# EAGLE design EEG (EAGLE 6.3)
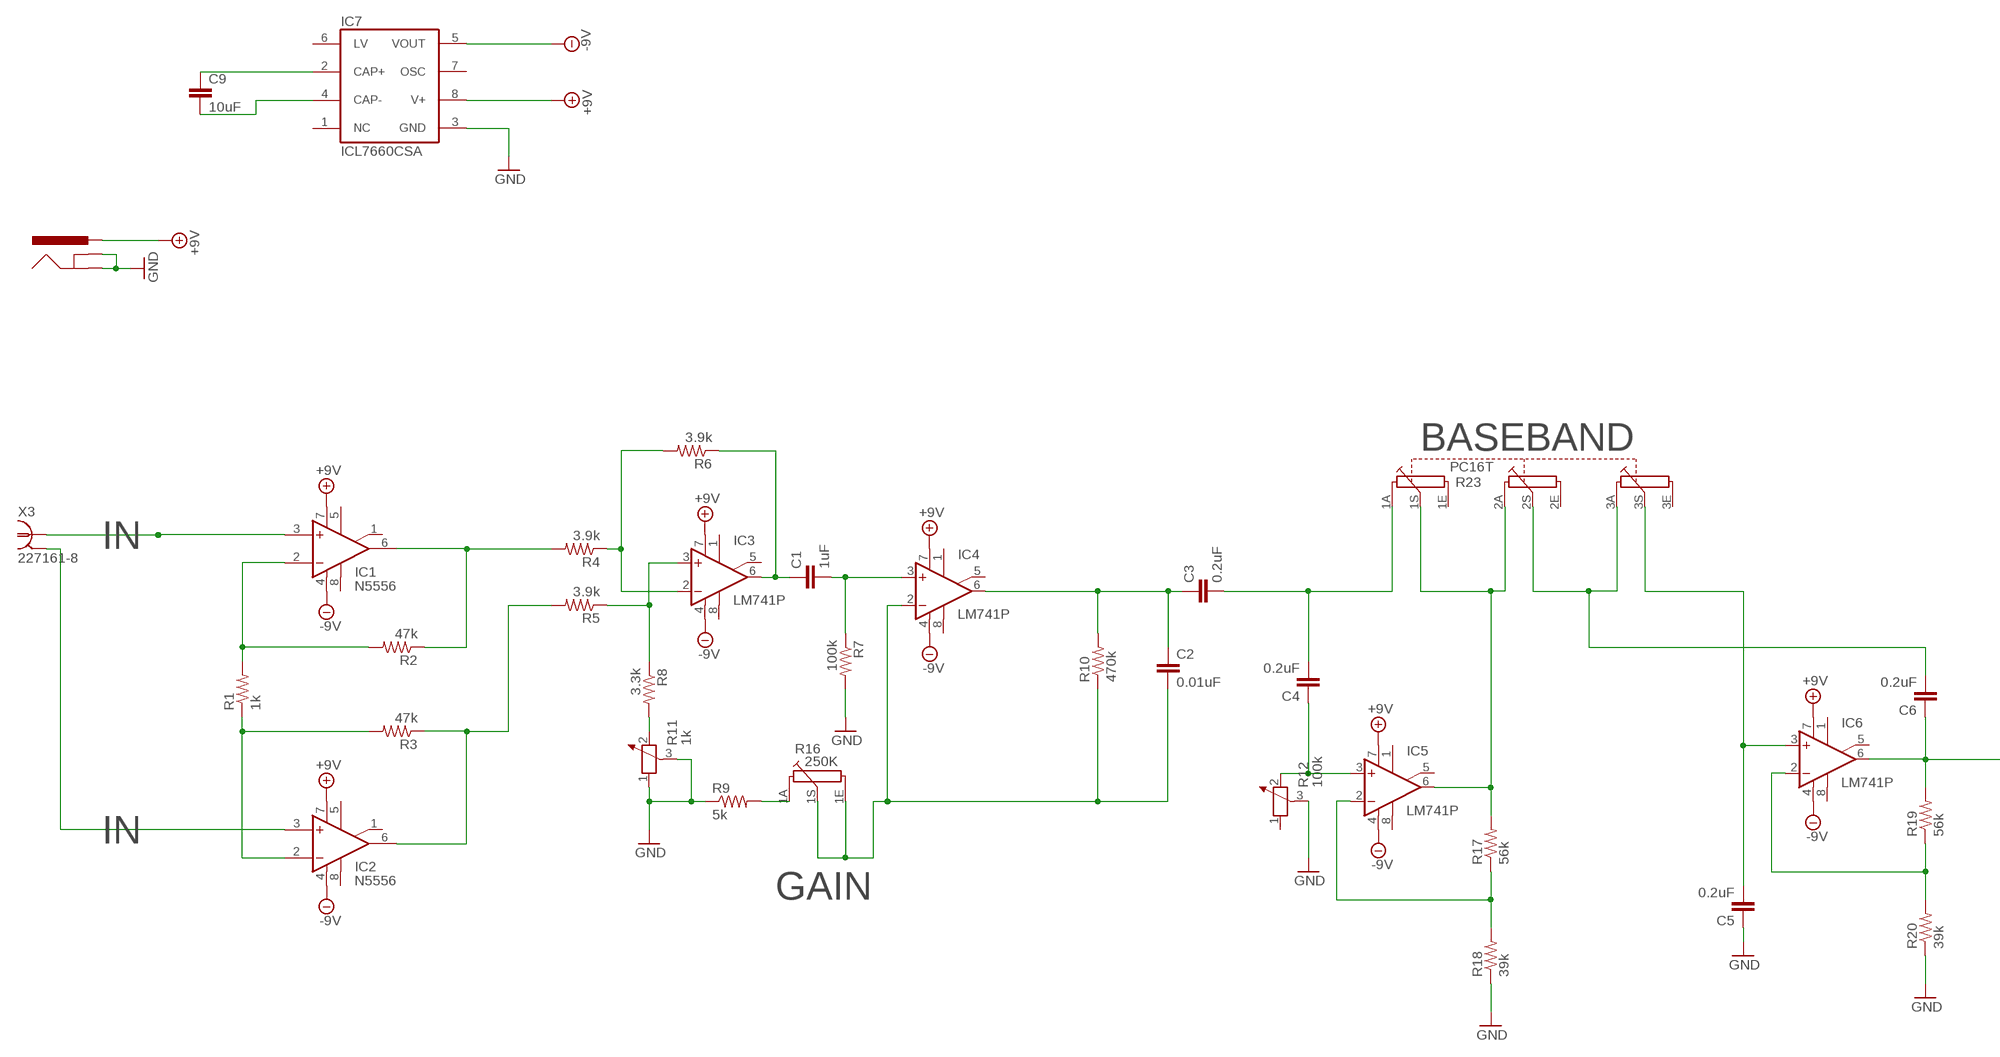
[diagram p0: schematic, sheet 1, part 1 of 2]
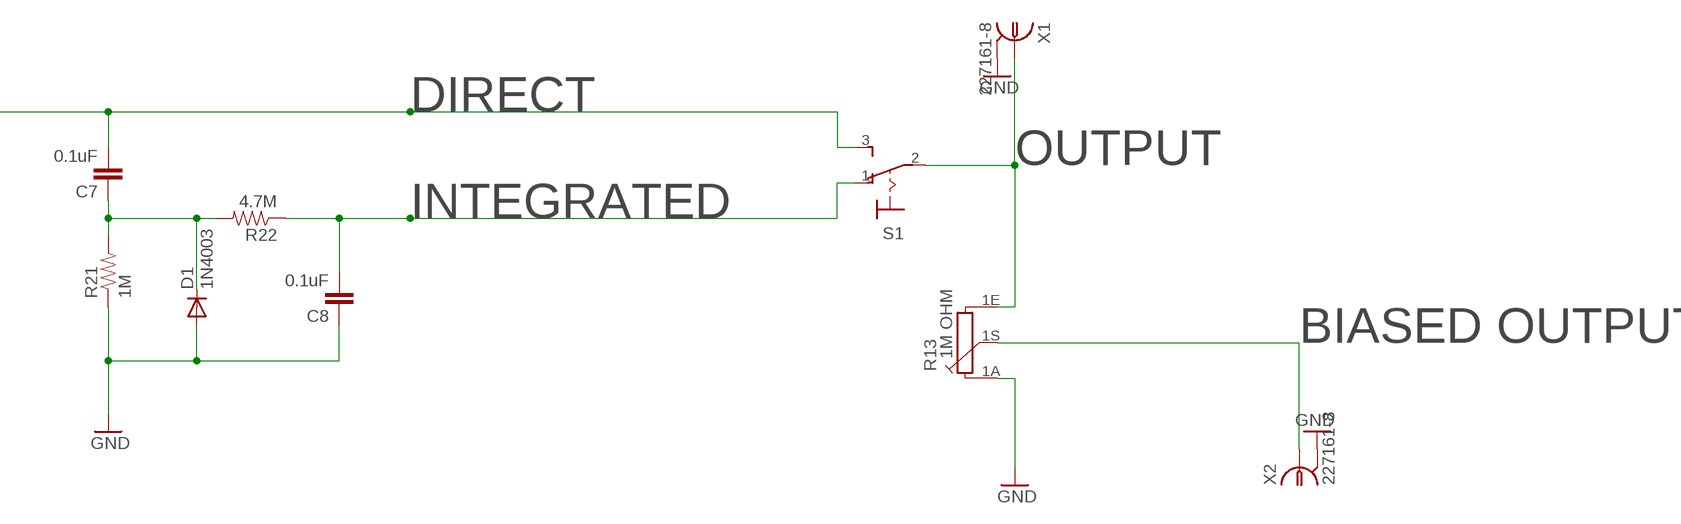
[diagram p1: schematic, sheet 1, part 2 of 2]

## Parts
C1  1uF  C-EUC1206  [C1206]
C2  0.01uF  C-EUC1206  [C1206]
C3  0.2uF  C-EUC1206  [C1206]
C4  0.2uF  C-EUC1206  [C1206]
C5  0.2uF  C-EUC1206  [C1206]
C6  0.2uF  C-EUC1206  [C1206]
C7  0.1uF  C-EUC1206  [C1206]
C8  0.1uF  C-EUC1206  [C1206]
C9  10uF  C-EUC1206  [C1206]
D1  1N4003  1N4004  [DO41-10]
IC1  N5556  MAX430CPA  [DIL08]
IC2  N5556  MAX430CPA  [DIL08]
IC3  LM741P  [DIL08]
IC4  LM741P  [DIL08]
IC5  LM741P  [DIL08]
IC6  LM741P  [DIL08]
IC7  ICL7660CSA  [SO08]
J1  SPARKFUN_POWER_JACKPTH  [SPARKFUN_POWER_JACK_PTH]
R1  1k  SPARKFUN_RESISTOR1206  [SPARKFUN_1206]
R2  47k  SPARKFUN_RESISTOR1206  [SPARKFUN_1206]
R3  47k  SPARKFUN_RESISTOR1206  [SPARKFUN_1206]
R4  3.9k  SPARKFUN_RESISTOR1206  [SPARKFUN_1206]
R5  3.9k  SPARKFUN_RESISTOR1206  [SPARKFUN_1206]
R6  3.9k  SPARKFUN_RESISTOR1206  [SPARKFUN_1206]
R7  100k  SPARKFUN_RESISTOR1206  [SPARKFUN_1206]
R8  3.3k  SPARKFUN_RESISTOR1206  [SPARKFUN_1206]
R9  5k  SPARKFUN_RESISTOR1206  [SPARKFUN_1206]
R10  470k  SPARKFUN_RESISTOR1206  [SPARKFUN_1206]
R11  1k  POTENTIOMETER_PT-10  [PT-10]
R12  100k  POTENTIOMETER_PT-10  [PT-10]
R13  1M OHM  PC16S  [PC16S]
R16  250K  PC16S  [PC16S]
R17  56k  SPARKFUN_RESISTOR1206  [SPARKFUN_1206]
R18  39k  SPARKFUN_RESISTOR1206  [SPARKFUN_1206]
R19  56k  SPARKFUN_RESISTOR1206  [SPARKFUN_1206]
R20  39k  SPARKFUN_RESISTOR1206  [SPARKFUN_1206]
R21  1M  SPARKFUN_RESISTOR1206  [SPARKFUN_1206]
R22  4.7M  SPARKFUN_RESISTOR1206  [SPARKFUN_1206]
R23  PC16T  [PC16T]
S1  M9040P  [M9040P]
X1  227161-8  [AMP_227161]
X2  227161-8  [AMP_227161]
X3  227161-8  [AMP_227161]

## Nets
+9V: IC1.7(V+) IC2.7(V+) IC3.7(V+) IC4.7(V+) IC5.7(V+) IC6.7(V+) IC7.8(V+) J1.PWR
-9V: IC1.4(V-) IC2.4(V-) IC3.4(V-) IC4.4(V-) IC5.4(V-) IC6.4(V-) IC7.5(VOUT)
BIASOUT: R13.1S X2.1
DIRECT: C6.1 C7.2 IC6.6(OUT) R19.2 S1.3(S)
GND: C5.1 C8.1 D1.A IC7.3(GND) J1.GND J1.GNDBREAK R7.2 R9.1 R11.1 R11.3 R12.3 R13.1A R18.1 R20.1 R21.1 X1.2(GND) X2.2(GND)
IN0: IC1.3(+IN) X3.1
IN1: IC2.3(+IN) X3.2(GND)
INT: C8.2 R22.1 S1.1(O)
N$1: IC1.2(-IN) R1.2 R2.2
N$2: IC2.2(-IN) R1.1 R3.2
N$3: R9.2 R16.1A
N$5: IC1.6(OUT) R2.1 R4.2
N$6: IC2.6(OUT) R3.1 R5.2
N$7: IC3.2(-IN) R4.1 R6.2
N$8: IC3.3(+IN) R5.1 R8.1
N$9: C1.1 IC3.6(OUT) R6.1
N$10: C1.2 IC4.3(+IN) R7.1
N$11: R8.2 R11.2
N$12: C9.1 IC7.2(CAP+)
N$14: C2.2 IC4.2(-IN) R10.1 R16.1E R16.1S
N$15: C2.1 C3.1 IC4.6(OUT) R10.2
N$16: C3.2 C4.2 R23.1A
N$17: IC5.6(OUT) R17.2 R23.1S R23.2A
N$18: C7.1 D1.C R21.2 R22.2
N$19: C6.2 R23.2S R23.3A
N$20: C9.2 IC7.4(CAP-)
N$21: C5.2 IC6.3(+IN) R23.3S
N$22: C4.1 IC5.3(+IN) R12.2
N$24: IC5.2(-IN) R17.1 R18.2
N$27: IC6.2(-IN) R19.1 R20.2
OUT: R13.1E S1.2(P) X1.1
Unconnected: IC1.1(NC) IC1.5(NC) IC1.8(NC) IC2.1(NC) IC2.5(NC) IC2.8(NC) IC3.1(ON1) IC3.5(ON2) IC3.8(OPT) IC4.1(ON1) IC4.5(ON2) IC4.8(OPT) IC5.1(ON1) IC5.5(ON2) IC5.8(OPT) IC6.1(ON1) IC6.5(ON2) IC6.8(OPT) IC7.1(NC) IC7.6(LV) IC7.7(OSC) R12.1 R23.1E R23.2E R23.3E

## Notes on the sheet
- BASEBAND
- IN
- N5556
- DIRECT
- OUTPUT
- IN | INTEGRATED
- N5556
- GAIN
- BIASED OUTPUT

## Library data of the parts
C1-C8 = resistor:C-EU: CAPACITOR, European symbol
C9 = rcl:C-EU: CAPACITOR, European symbol
D1 = diode:1N4004: DIODE general purpose rectifier, 1 A
IC1 IC2 = maxim:MAX430CPA: OP AMP; OC_FARNELL: unknown; OC_NEWARK: unknown
IC3-IC6 = linear:*741: OP AMP
IC7 = maxim:ICL7660CSA: VOLTAGE CONVERTER; MF: MAXIM; MPN: ICL7660CSA; OC_FARNELL: 9724710; OC_NEWARK: 34C3732
J1 = Arduino-Pro-v12:SPARKFUN_POWER_JACK: Power Jack This is the standard 5.5mm barrel jack for power. The PTH is the most common, proven, reliable, footprint. All others are experimental. The Slot footprint only works if the mill layer is transmitted to the PCB fab house so be warned. Spark Fun Electronics SKU : PRT-00119. Mating wall wart : TOL-00298 (and others)
R1-R10 R17-R22 = Arduino-Pro-v12:SPARKFUN_RESISTOR: Resistor Basic schematic elements and footprints for 0603, 1206, and PTH 1/10th watt (small) resistors.
R11 R12 = rcl:POTENTIOMETER_: Potentiometer
R13 R16 = piher:PC16S: POTENTIOMETER single carbon potentiometer, 16 mm, S3ROH; OC_FARNELL: 4452940; OC_NEWARK: unknown
R23 = piher:PC16T: POTENTIOMETER triple carbon potentiometer, 16 mm; OC_FARNELL: unknown; OC_NEWARK: unknown
S1 = switch:M9040P: TOGGLE SWITCH Marquardt
X1-X3 = con-coax:?227161*: JACK, RIGHT ANGLE, 50 OHM, PCB, BNC Source: amp_227161.pdf; OC_FARNELL: unknown; OC_NEWARK: unknown

## Board
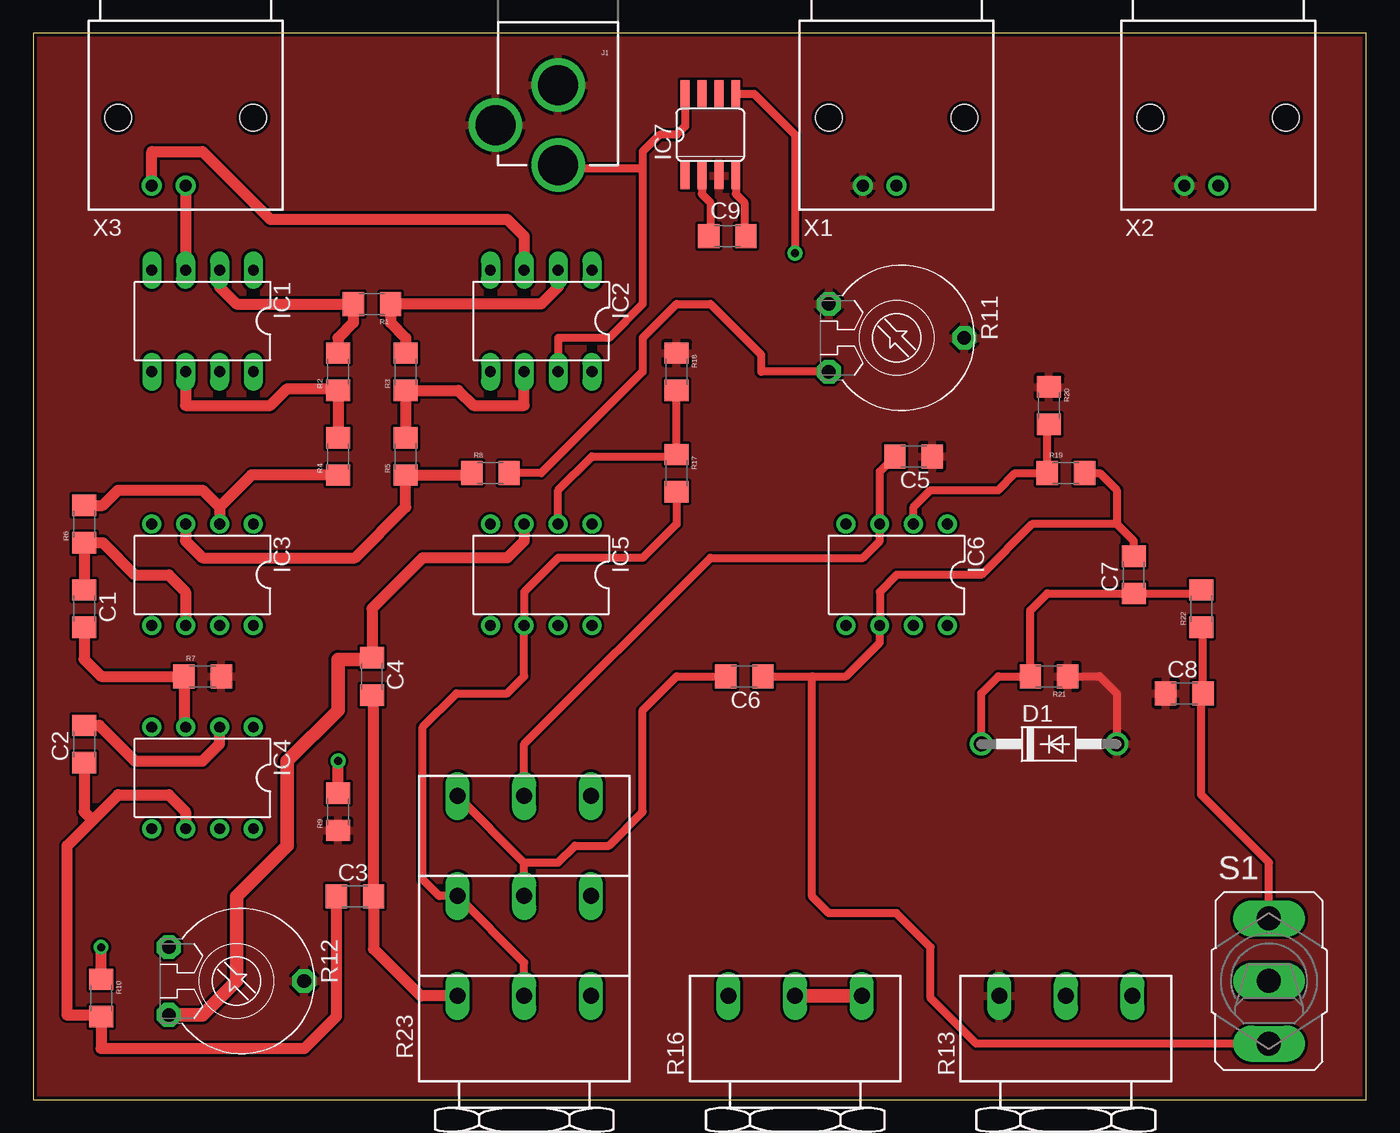
[diagram p2: board, top side]
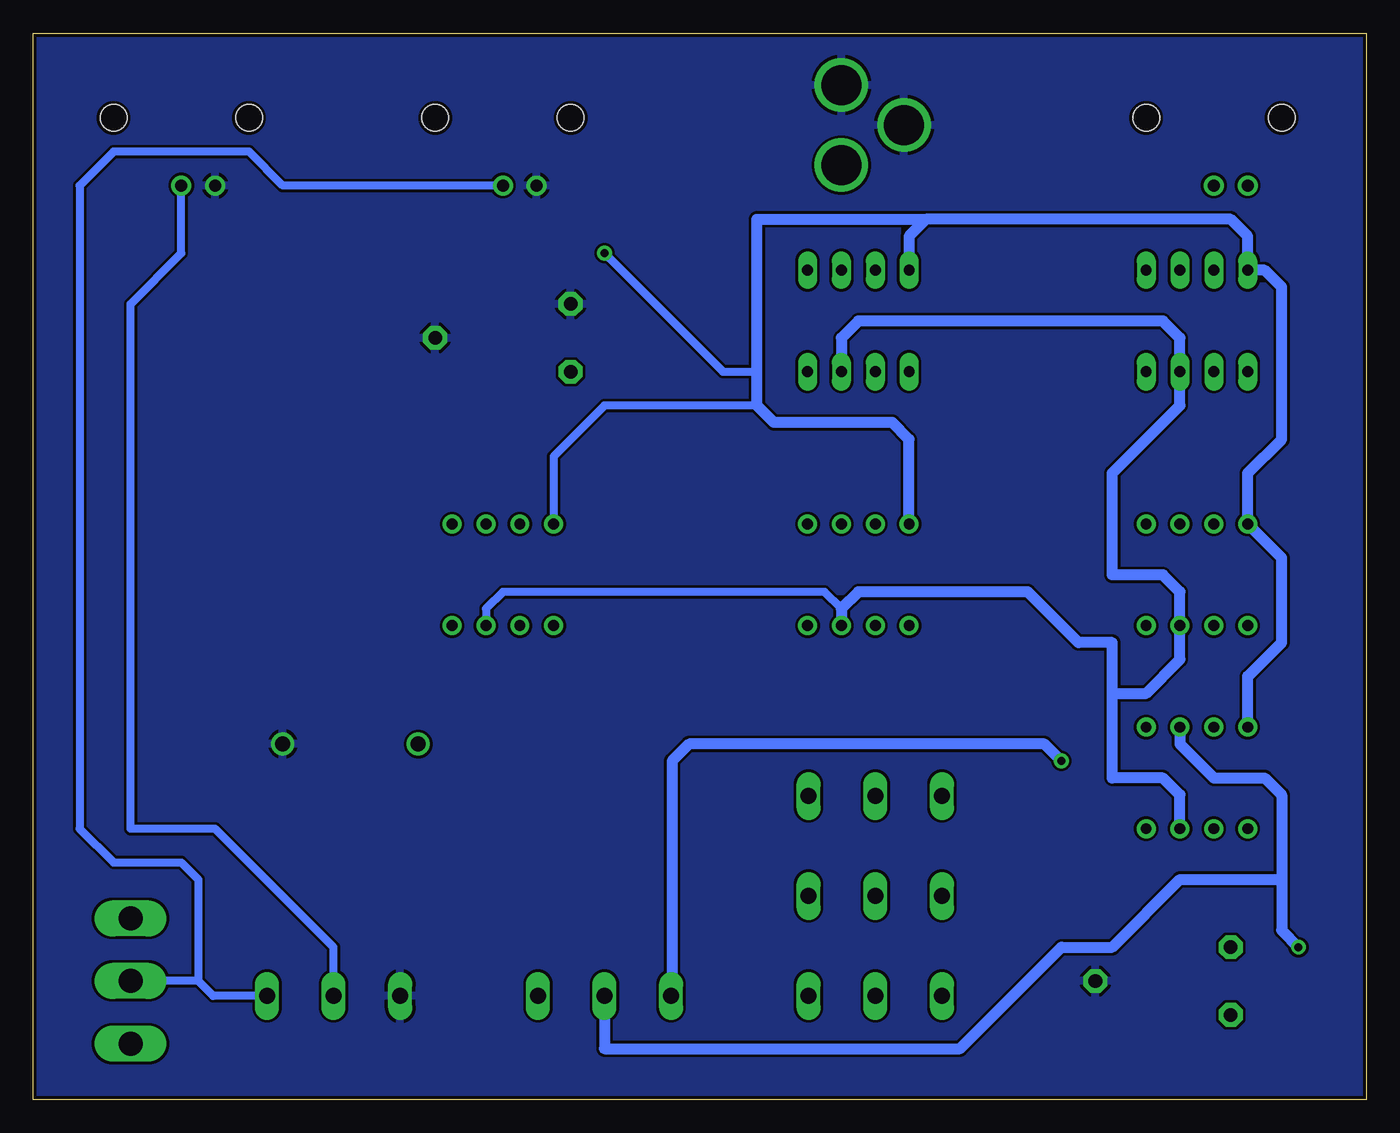
[diagram p3: board, bottom side, seen from below]

Size 100 x 80 mm. Coordinates in mm from the lower left corner, seen from the top.
Outline: 0,0 100,0 100,80 0,80 0,0
Copper layers (1*16): Top 0.035mm / dielectric 1.5mm / Bottom 0.035mm
Design rules "SparkFun": minimum track width 8mil, minimum drill 20mil, track to track 8mil, track to pad 8mil, pad to pad 8mil, via to via 8mil, smd to smd 8mil, copper to edge 10mil, drill to drill 8mil, minimum pad ring 12mil, minimum via ring 10mil, stop-mask expansion 4mil, vias tented up to drill 25mil, thermal gap 10mil

### Footprints (pad centres in the part's own frame; a part is rotated, then mirrored left to right if it is on the bottom)
C1206 = smd 1.6 x 1.8: 1 -1.4,0; 2 1.4,0
DO41-10 = drill 1.118: A 5.08,0; C -5.08,0
DIL08 = drill 0.813 long: 1 -3.81,-3.81; 2 -1.27,-3.81; 3 1.27,-3.81; 4 3.81,-3.81; 5 3.81,3.81; 6 1.27,3.81; 7 -1.27,3.81; 8 -3.81,3.81
DIL08' = drill 0.813 pad 1.27: 1 -3.81,-3.81; 2 -1.27,-3.81; 3 1.27,-3.81; 4 3.81,-3.81; 5 3.81,3.81; 6 1.27,3.81; 7 -1.27,3.81; 8 -3.81,3.81
SO08 = smd 0.66 x 2.032: 1 -1.905,-3.073; 2 -0.635,-3.073; 3 0.635,-3.073; 4 1.905,-3.073; 5 1.905,3.073; 6 0.635,3.073; 7 -0.635,3.073; 8 -1.905,3.073
SPARKFUN_POWER_JACK_PTH = drill 2.997: GND 0,7.7; GNDBREAK 4.7,10.7; PWR 0,13.7
SPARKFUN_1206 = smd 1.6 x 1.8: 1 -1.4,0; 2 1.4,0
PT-10 = drill 1.016 pad 1.778 octagon: 1 -2.54,-5.08; 2 2.54,-5.08; 3 0,5.08
PC16S = drill 1.2 long: 1A -5,6.5; 1E 5,6.5; 1S 0,6.5
PC16T = drill 1.2 long: 1A -5,6.5; 1E 5,6.5; 1S 0,6.5; 2A -5,14; 2E 5,14; 2S 0,14; 3A -5,21.5; 3E 5,21.5; 3S 0,21.5
M9040P = drill 1.803 long: 1 0,4.699; 2 0,0; 3 0,-4.699
AMP_227161 = drill 0.9 pad 1.27: 1 0,-5.08; 2 -2.54,-5.08 | hole 2: -5.08,0; 5.08,0

### Placement (x,y rotation side)
C1  3.81,36.83 270 top
C2  3.81,26.67 90 top
C3  24.13,15.24 0 top
C4  25.4,31.75 270 top
C5  66.04,48.26 180 top
C6  53.34,31.75 180 top
C7  82.55,39.37 90 top
C8  86.36,30.48 0 top
C9  52.07,64.77 0 top
D1  76.2,26.67 0 top
IC1  12.7,58.42 180 top
IC2  38.1,58.42 180 top
IC3  LM741P  [DIL08']  12.7,39.37 180 top
IC4  LM741P  [DIL08']  12.7,24.13 180 top
IC5  LM741P  [DIL08']  38.1,39.37 180 top
IC6  LM741P  [DIL08']  64.77,39.37 180 top
IC7  50.8,72.39 0 top
J1  39.37,83.82 180 top
R1  25.4,59.69 180 top
R2  22.86,54.61 90 top
R3  27.94,54.61 90 top
R4  22.86,48.26 90 top
R5  27.94,48.26 90 top
R6  3.81,43.18 90 top
R7  12.7,31.75 0 top
R8  34.29,46.99 0 top
R9  22.86,21.59 90 top
R10  5.08,7.62 270 top
R11  64.77,57.15 270 top
R12  15.24,8.89 270 top
R13  77.47,1.27 0 top
R16  57.15,1.27 0 top
R17  48.26,46.99 270 top
R18  48.26,54.61 270 top
R19  77.47,46.99 0 top
R20  76.2,52.07 270 top
R21  76.2,31.75 180 top
R22  87.63,36.83 90 top
R23  36.83,1.27 0 top
S1  92.71,8.89 0 top
X1  64.77,73.66 0 top
X2  88.9,73.66 0 top
X3  11.43,73.66 0 top

### Tracks (layer width: path | path; a pad name or v marks a point on that pad's centre or on a via)
+9V
  Top 0.61: 45.72,69.85 39.64,69.85 J1.PWR | 45.72,69.85 45.72,59.69 43.18,57.15 39.37,57.15 IC2.7 | IC7.8 48.9,73.03 48.26,72.39 46.99,72.39 45.72,71.12 45.72,69.85
  Bottom 0.61: 39.37,36.83 40.64,38.1 64.77,38.1 66.04,36.83 IC6.7
  Bottom 0.813: IC4.7 13.97,22.86 15.24,24.13 19.05,24.13 19.05,30.48 | 19.05,30.48 16.51,30.48 13.97,33.02 IC3.7 13.97,38.1 15.24,39.37 19.05,39.37 19.05,46.99 13.97,52.07 IC1.7 13.97,57.15 15.24,58.42 38.1,58.42 39.37,57.15 IC2.7 | 19.05,30.48 19.05,34.29 21.59,34.29 25.4,38.1 38.1,38.1 39.37,36.83 IC5.7
-9V  (via drill 0.6)
  Top 0.61: IC7.5 54.08,75.46 57.15,72.39 v57.15,63.5
  Bottom 0.61: v57.15,63.5 48.26,54.61 45.72,54.61 | 45.72,52.07 57.15,52.07 60.96,48.26 IC6.4
  Bottom 0.813: IC4.4 8.89,31.75 6.35,34.29 6.35,40.64 IC3.4 8.89,46.99 6.35,49.53 6.35,60.96 7.62,62.23 IC1.4 8.89,64.77 10.16,66.04 33.02,66.04 | 33.02,66.04 34.29,64.77 IC2.4 | IC5.4 34.29,49.53 35.56,50.8 44.45,50.8 45.72,52.07 45.72,54.61 45.72,66.04 33.02,66.04
BIASOUT
  Bottom 0.61: R13.1S 77.47,11.43 86.36,20.32 92.71,20.32 92.71,59.69 88.9,63.5 X2.1
DIRECT
  Top 0.61: C6.1 58.42,31.75 | 58.42,31.75 60.96,31.75 63.5,34.29 IC6.6 63.5,38.1 64.77,39.37 71.12,39.37 74.93,43.18 81.28,43.18 | C7.2 82.55,41.91 81.28,43.18 | R19.2 80.01,46.99 81.28,45.72 81.28,43.18 | S1.3 70.74,4.19 67.31,7.62 67.31,11.43 64.77,13.97 59.69,13.97 58.42,15.24 58.42,31.75
GND
  Top 0.61: R21.1 80.01,31.75 81.28,30.48 D1.A
  pour Bottom: 0,80.01 0,0 100.33,0 100.33,80.01
  pour Top: 0,80.01 0,0 100.33,0 100.33,80.01
IN0
  Top 0.813: X3.1 IC1.3
IN1
  Top 0.813: X3.2 8.89,71.12 12.7,71.12 17.78,66.04 35.56,66.04 36.83,64.77 IC2.3
INT
  Top 0.61: S1.1 92.71,17.78 87.63,22.86 87.63,30.35 C8.2 87.76,35.3 R22.1
N$1
  Top 0.813: IC1.2 13.97,60.96 15.24,59.69 R1.2 24,58.29 22.86,57.15 R2.2
N$2
  Top 0.813: IC2.2 39.37,60.96 38.1,59.69 R1.1 26.8,58.29 27.94,57.15 R3.2
N$3  (via drill 0.6)
  Top 0.813: R9.2 v22.86,25.4
  Bottom 0.813: v22.86,25.4 24.13,26.67 50.8,26.67 52.07,25.4 52.07,7.85 R16.1A
N$5
  Top 0.813: IC1.6 11.43,52.07 17.78,52.07 19.05,53.34 22.73,53.34 R2.1 R4.2
N$6
  Top 0.813: IC2.6 36.83,52.07 33.02,52.07 31.88,53.21 R3.1 R5.2
N$7
  Top 0.813: R4.1 16.38,46.86 13.97,44.45 | 13.97,44.45 IC3.2 | R6.2 5.21,44.58 6.35,45.72 12.7,45.72 13.97,44.45
N$8
  Top 0.813: IC3.3 11.43,41.91 12.7,40.64 24.13,40.64 27.94,44.45 R5.1 32.76,46.86 R8.1
N$9
  Top 0.813: C1.1 R6.1 5.21,41.78 7.62,39.37 10.16,39.37 11.43,38.1 IC3.6
N$10
  Top 0.813: C1.2 3.81,33.02 5.08,31.75 R7.1 11.3,28.07 IC4.3
N$11
  Top 0.61: R11.2 54.61,54.61 54.61,55.88 50.8,59.69 48.26,59.69 45.72,57.15 45.72,54.61 38.1,46.99 R8.2
N$12
  Top 0.61: IC7.2 50.16,67.94 50.8,67.31 50.8,64.77 C9.1
N$14  (via drill 0.6)
  Top 0.813: C2.2 4.95,28.07 7.62,25.4 12.7,25.4 13.97,26.67 IC4.2 | R10.1 v5.08,11.43
  Top 1.016: R16.1S R16.1E
  Bottom 0.813: IC4.2 13.97,26.67 11.43,24.13 7.62,24.13 6.35,22.86 6.35,16.51 | R16.1S 57.15,3.81 30.48,3.81 22.86,11.43 19.05,11.43 13.97,16.51 6.35,16.51 | 6.35,16.51 6.35,12.7 v5.08,11.43
N$15
  Top 0.813: IC4.6 11.43,21.59 10.16,22.86 6.35,22.86 4.45,20.95 | C2.1 3.81,21.59 4.45,20.95 | 4.45,20.95 2.54,19.05 2.54,6.35 4.95,6.35 R10.2 5.08,3.81 20.32,3.81 22.73,6.22 C3.1
N$16
  Top 0.813: R23.1A 29.06,7.77 25.53,11.3 C3.2 25.53,30.22 C4.2
N$17
  Top 0.61: R17.2 48.26,43.18 45.72,40.64 39.37,40.64 36.83,38.1 IC5.6 36.83,31.75 35.56,30.48 31.75,30.48 29.21,27.94 29.21,16.51 30.45,15.27 R23.2A 36.83,10.27 R23.1S
N$18
  Top 0.61: D1.C 71.12,30.48 72.39,31.75 R21.2 74.8,36.7 76.07,37.97 C7.1 87.37,37.97 R22.2
N$19
  Top 0.61: R23.3A 36.83,17.77 R23.2S 36.83,17.78 39.37,17.78 40.64,19.05 43.18,19.05 45.72,21.59 45.72,29.21 48.26,31.75 C6.2
N$20
  Top 0.61: IC7.4 52.7,67.94 53.34,67.31 53.34,64.9 C9.2
N$21
  Top 0.61: R23.3S 36.83,26.67 50.8,40.64 62.23,40.64 63.5,41.91 IC6.3 63.5,47.12 C5.2
N$22
  Top 0.813: IC5.3 36.83,41.91 35.56,40.64 29.21,40.64 25.4,36.83 C4.1
  Top 1.016: R12.2 12.7,6.35 15.24,8.89 15.24,15.24 19.05,19.05 19.05,25.4 22.86,29.21 22.86,33.02 25.27,33.02 C4.1
N$24
  Top 0.61: IC5.2 39.37,45.72 41.91,48.26 48.13,48.26 R17.1 R18.2
N$27
  Top 0.61: IC6.2 66.04,44.45 67.31,45.72 72.39,45.72 73.66,46.99 R19.1 76.07,50.54 R20.2
OUT
  Bottom 0.61: R13.1E 86.51,7.77 87.63,8.89 | 87.63,8.89 S1.2 | X1.1 81.28,68.58 83.82,71.12 93.98,71.12 96.52,68.58 96.52,20.32 93.98,17.78 88.9,17.78 87.63,16.51 87.63,8.89

### Text on the board
tNames: IN | OUTPUT | BIASED OUTPUT | +9V | BASEBAND | GAIN | BIAS